# Altium schematic sheet 008_Fan_GPIO_LED.SchDoc: =title_line_1 + title_line_2
size 594 x 420 mm; SheetNumber: 8
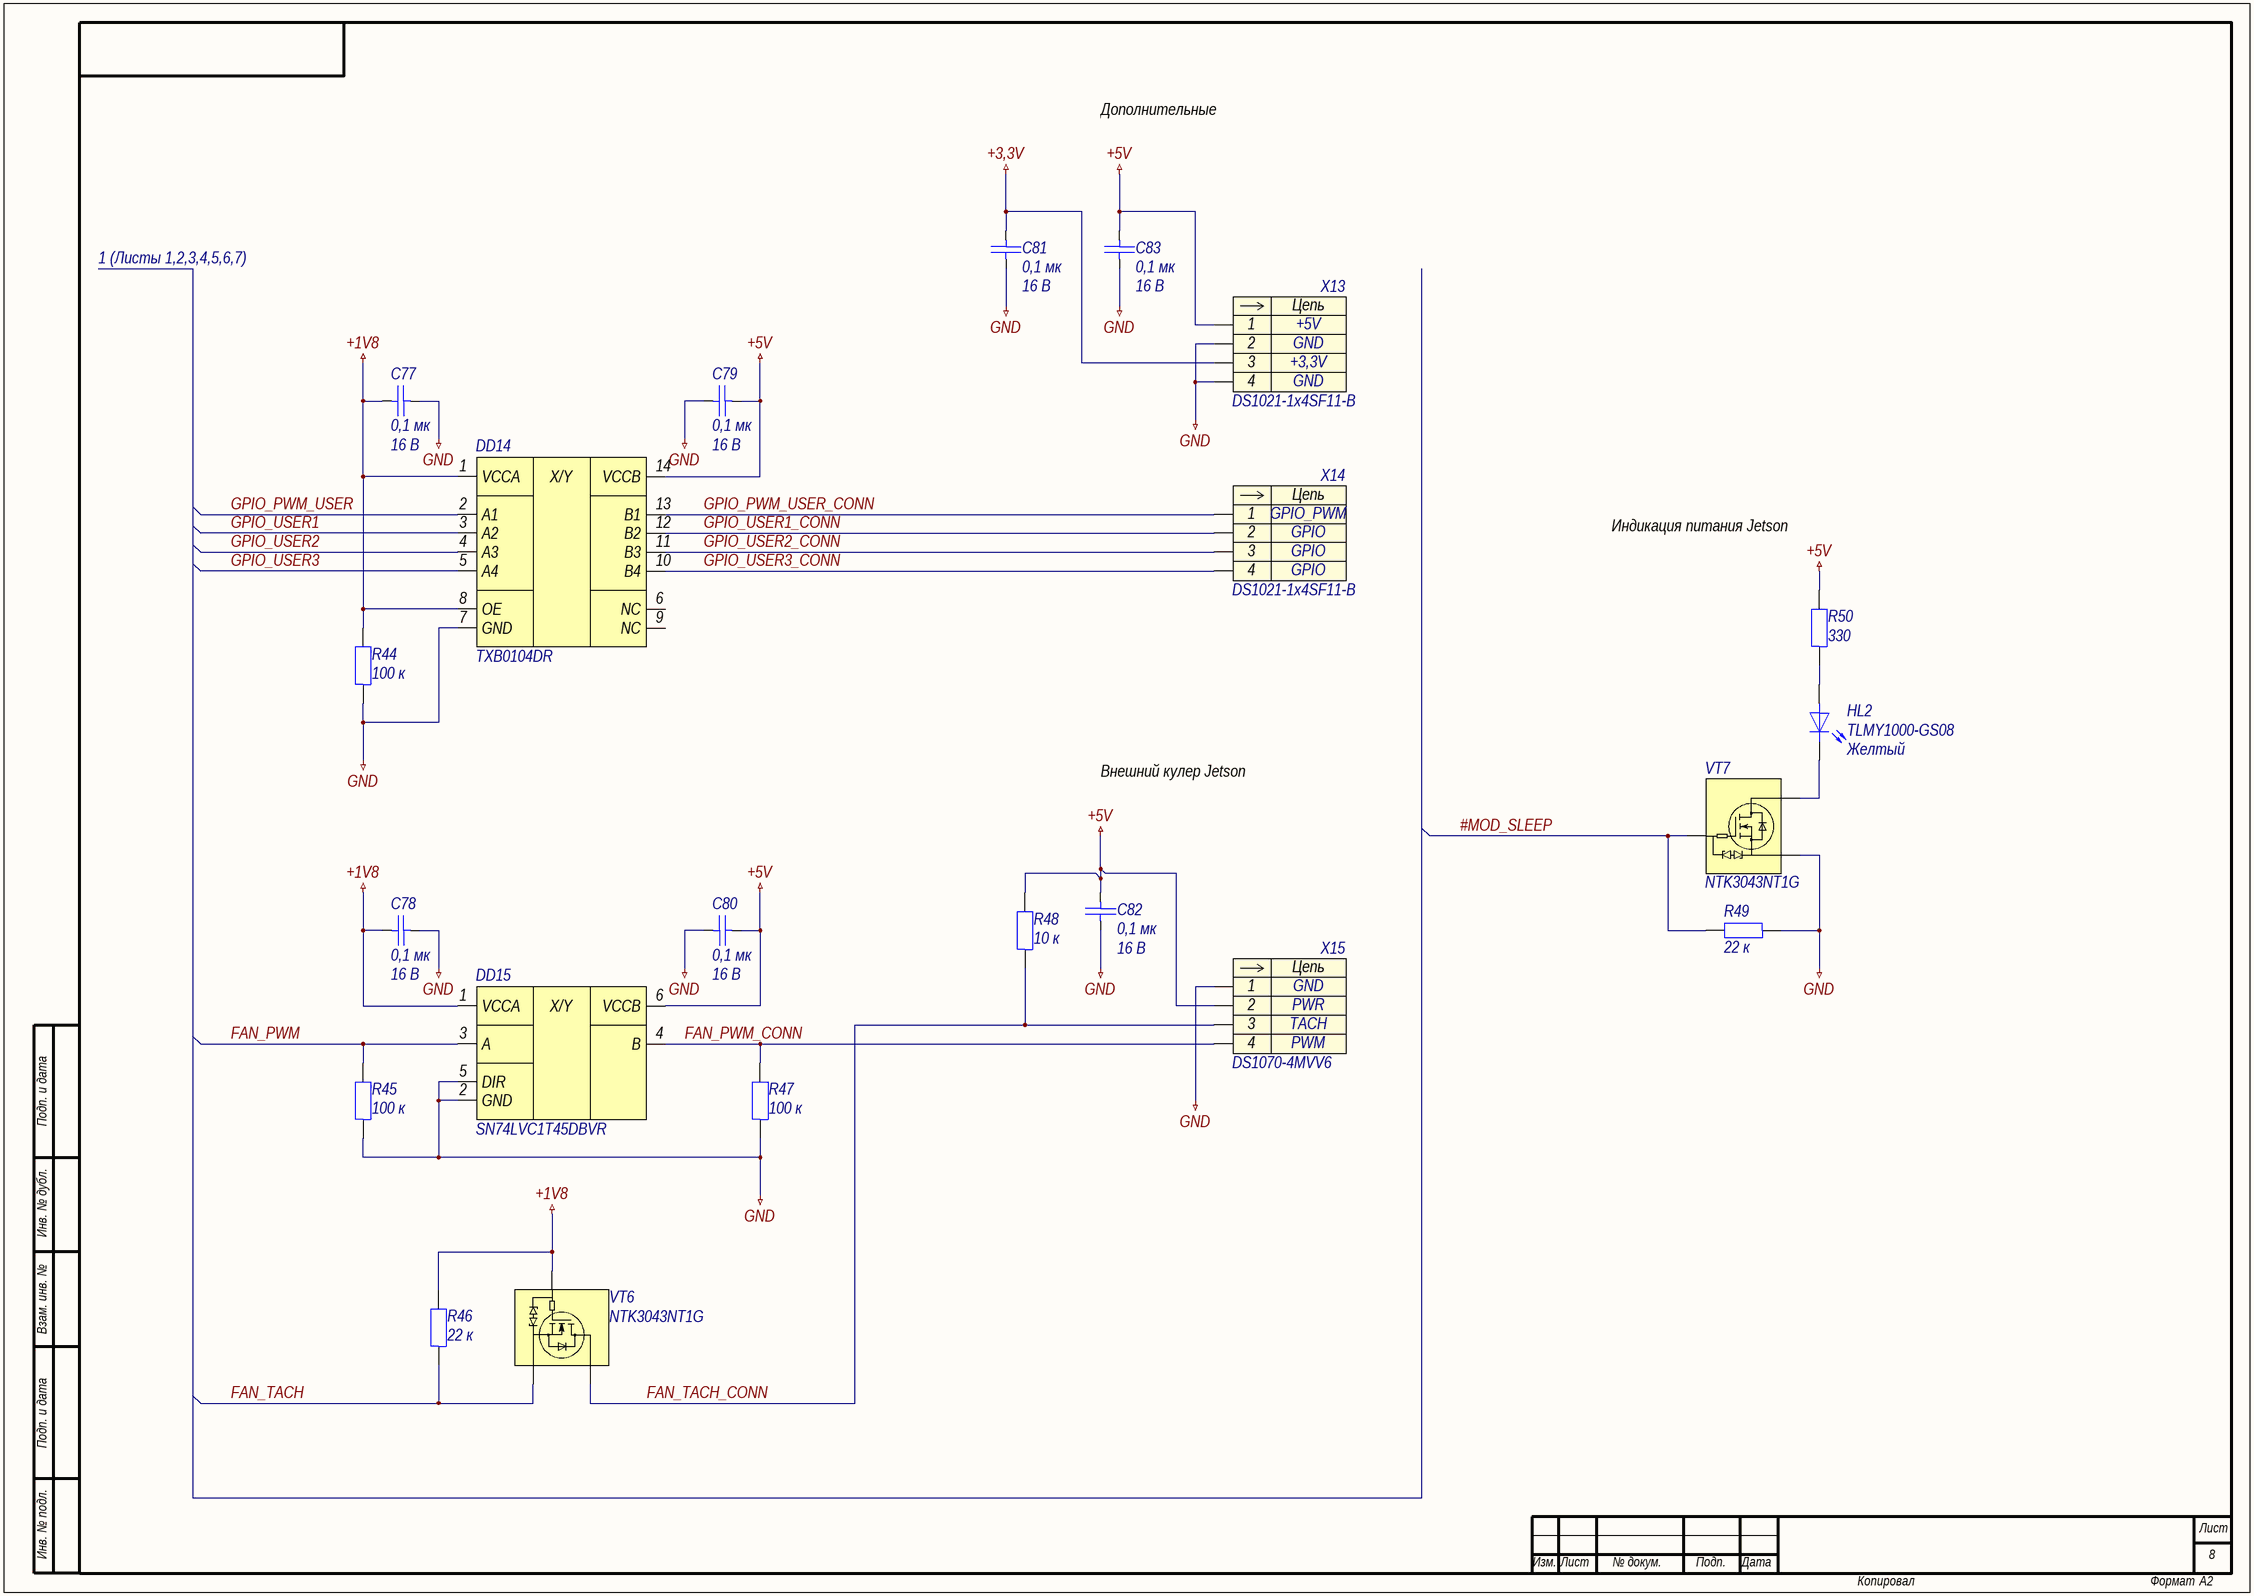
[diagram p0: 008_Fan_GPIO_LED.SchDoc]

## Parts
C77  0,1 мк  Напряжение: 16 В  [C0603]
C78  0,1 мк  Напряжение: 16 В  [C0603]
C79  0,1 мк  Напряжение: 16 В  [C0603]
C80  0,1 мк  Напряжение: 16 В  [C0603]
C81  0,1 мк  Напряжение: 16 В  [C0603]
C82  0,1 мк  Напряжение: 16 В  [C0603]
C83  0,1 мк  Напряжение: 16 В  [C0603]
DD14  TXB0104DR  [SOIC-14-P127-865X390X175-L84X41]
DD15  SN74LVC1T45DBVR  [SOT-23-6-P95-290X280X145]
HL2  TLMY1000-GS08  Цвет: Желтый  [HL0603]
R44  100 к  [R0603]
R45  100 к  [R0603]
R46  22 к  [R0603]
R47  100 к  [R0603]
R48  10 к  [R0603]
R49  22 к  [R0603]
R50  330  [R0603]
VT6  NTK3043NT1G  [SOT-723-3-P40-120X120X55]
VT7  NTK3043NT1G  [SOT-723-3-P40-120X120X55]
X13  DS1021-1x4SF11-B  [DS1021-1X4SF11-B]
X14  DS1021-1x4SF11-B  [DS1021-1X4SF11-B]
X15  DS1070-4MVV6  [DS1070-4MVV6]

## Nets
+1V8: C77.1 C78.1 DD14.1(VCCA) DD14.8(OE) DD15.1(VCCA) R44.2 R46.2 VT6.G
+3,3V: C81.2 X13.3
+5V: C79.2 C80.1 C82.2 C83.2 DD14.14(VCCB) DD15.6(VCCB) R48.2 R50.2 X13.1 X15.2
GND: C77.2 C78.2 C79.1 C80.2 C81.1 C82.1 C83.1 DD14.7(GND) DD15.2(GND) DD15.5(DIR) R44.1 R45.1 R47.1 R49.1 VT7.S X13.2 X13.4 X15.1
#MOD_SLEEP: R49.2 VT7.G
FAN_PWM: DD15.3(A) R45.2
FAN_PWM_CONN: DD15.4(B) R47.2 X15.4
FAN_TACH: R46.1 VT6.S
FAN_TACH_CONN: R48.1 VT6.D X15.3
GPIO_PWM_USER: DD14.2(A1)
GPIO_PWM_USER_CONN: DD14.13(B1) X14.1
GPIO_USER1: DD14.3(A2)
GPIO_USER1_CONN: DD14.12(B2) X14.2
GPIO_USER2: DD14.4(A3)
GPIO_USER2_CONN: DD14.11(B3) X14.3
GPIO_USER3: DD14.5(A4)
GPIO_USER3_CONN: DD14.10(B4) X14.4
NetHL2_1: HL2.1 VT7.D
NetHL2_2: HL2.2 R50.1

Not connected (* = marked no-connect by the designer): DD14 6(NC) 9(NC)

## Notes on the sheet
- Дополнительные функции
- 1 (Листы 1,2,3,4,5,6,7)
- Индикация питания Jetson Nano
- Внешний кулер Jetson Nano
- Подп. и дата
- Инв. № дубл.
- Взам. инв. №
- Инв. № подл.
- Лист
- Изм.
- № докум.
- Подп.
- Дата
- Копировал
- Формат
- А2
- (in symbol dd0001) X/Y
- (in symbol dd0002) X/Y
- (in symbol x0027) Цепь
- (in symbol x0048) Цепь

## Library data of the parts
C77-C83 = c0081: =Описание; ID: c0081; Фамилия: Паньков; Описание: Конденсатор керамический чип 0603 100 нФ 16 В ±10 %; Наименование: CC0603KRX7R7BB104; Производитель: YAGEO Corp.; Отклонение: ±10 %; Рабочие температуры: от –55 °С до +125 °С; Температурный коэффициент емкости: X7R; Корпус: 0603; Номинал: 0,1 мк; Номинальное напряжение: 16 В; HelpURL: https://www.yageo.com/upload/media/product/productsearch/datasheet/mlcc/UPY-GPHC_X7R_6.3V-to-50V_20.pdf
DD14 = dd0002: =Описание; ID: dd0002; Фамилия: Ларионов; Описание: Преобразователь логического уровня 3,6 В и 5,5 В 4 линии; Производитель: Texas Instruments Inc.; Входное напряжение: от 1,2 В до 3,6 В; Выходное напряжение: от 1,65 В до 5,5 В; Рабочие температуры: от –40 °С до +85 °С; Корпус: SOIC-14; Наименование: TXB0104DR; HelpURL: https://www.ti.com/product/TXB0104
DD15 = dd0001: =Описание; ID: dd0001; Фамилия: Ларионов; Описание: Преобразователь логического уровня 5,5 В и 5,5 В 1 линия; Производитель: Texas Instruments Inc.; Входное напряжение: от 1,08 В до 5,5 В; Выходное напряжение: от 1,65 В до 5,5 В; Рабочие температуры: от –40 °С до +85 °С; Корпус: SOT-23-6; Наименование: SN74LVC1T45DBVR; HelpURL: https://www.ti.com/product/SN74LVC1T45
HL2 = hl0003: =Описание; ID: hl0003; Фамилия: Ларионов; Описание: Светодиод чип 0603 желтый; Производитель: Vishay Intertechnology, Inc.; Номинальная сила света: 7,5 мкд; Номинальная длина волны: 588 нм; Номинальный прямой ток: 15 мА; Номинальное падение напряжения: 1,8 В; Рассеиваемая мощность: 40 мВт; Рабочие температуры: от –40 °С до +100 °С; Корпус: 0603; Наименование: TLMY1000-GS08; HelpURL: https://www.vishay.com/leds/list/product-83172/
R44 R45 R47 = r0141: =Описание; ID: r0141; Фамилия: Водорезов; Описание: Резистор чип 0603 100 кОм ±1 % 0,1 Вт; Наименование: RC0603FR-07100KL; Производитель: YAGEO Corp.; Отклонение: ±1 %; Номинальное напряжение: 75 В; Номинальный ток: 1 А; Рабочие температуры: от –55 °С до +155 °С; Корпус: 0603; Примечание: Ряд E24; Номинал: 100 к; HelpURL: https://www.yageo.com/upload/media/product/productsearch/datasheet/rchip/PYu-RC_Group_51_RoHS_L_11.pdf
R46 R49 = r0117: =Описание; ID: r0117; Фамилия: Паньков; Описание: Резистор чип 0603 22 кОм ±1 % 0,1 Вт; Наименование: RC0603FR-0722KL; Производитель: YAGEO Corp.; Отклонение: ±1 %; Номинальное напряжение: 75 В; Номинальный ток: 1 А; Рабочие температуры: от –55 °С до +155 °С; Корпус: 0603; Примечание: Ряд E24; Номинал: 22 к; HelpURL: https://www.yageo.com/upload/media/product/productsearch/datasheet/rchip/PYu-RC_Group_51_RoHS_L_11.pdf
R48 = r0105: =Описание; ID: r0105; Фамилия: Самарин; Описание: Резистор чип 0603 10 кОм ±1 % 0,1 Вт; Наименование: RC0603FR-0710KL; Производитель: YAGEO Corp.; Отклонение: ±1 %; Номинальное напряжение: 75 В; Номинальный ток: 1 А; Рабочие температуры: от –55 °С до +155 °С; Корпус: 0603; Примечание: Ряд E24; Номинал: 10 к; HelpURL: https://www.yageo.com/upload/media/product/productsearch/datasheet/rchip/PYu-RC_Group_51_RoHS_L_11.pdf
R50 = r0064: =Описание; ID: r0064; Фамилия: Ларионов; Описание: Резистор чип 0603 330 Ом ±1 % 0,1 Вт; Наименование: RC0603FR-07330RL; Производитель: YAGEO Corp.; Отклонение: ±1 %; Номинальное напряжение: 75 В; Номинальный ток: 1 А; Рабочие температуры: от –55 °С до +155 °С; Корпус: 0603; Примечание: Ряд E24; Номинал: 330; HelpURL: https://www.yageo.com/upload/media/product/productsearch/datasheet/rchip/PYu-RC_Group_51_RoHS_L_11.pdf
VT6 VT7 = vt0001: =Описание; ID: vt0001; Фамилия: Ларионов; Описание: Полевой N-канальный МДП-транзистор 20 В 0,255 А; Производитель: ON Semiconductor; Напряжение затвор — исток: ±10 В; Напряжение сток — исток: 20 В; Ток стока: 0,255 А; Сопротивление сток — исток: 15 Ом; Рабочие температуры: от –55 °С до +150 °С; Корпус: SOT-723; Наименование: NTK3043NT1G; HelpURL: https://www.onsemi.com/products/discretes-drivers/mosfets/ntk3043n
X13 = x0027: =Описание; Contact_1: +5V; Contact_2: GND; Contact_3: +3,3V; ID: x0027; Фамилия: Паньков; Описание: PLS 4 pin 2,54 мм вилка прямой; Производитель: Connfly Electronic Co., Ltd.; Contact_4: GND; Наименование: DS1021-1x4SF11-B; HelpURL: http://en.connfly.group/product/xVkr=EusQssAN0gN=Aos=mU+UrVkR9kqEAN0gN9g+WqANB+A
X14 = x0027: =Описание; Contact_1: GPIO_PWM; Contact_2: GPIO; ID: x0027; Фамилия: Паньков; Описание: PLS 4 pin 2,54 мм вилка прямой; Производитель: Connfly Electronic Co., Ltd.; Contact_3: GPIO; Contact_4: GPIO; Наименование: DS1021-1x4SF11-B; HelpURL: http://en.connfly.group/product/xVkr=EusQssAN0gN=Aos=mU+UrVkR9kqEAN0gN9g+WqANB+A
X15 = x0048: =Описание; Contact_1: GND; Contact_2: PWR; Contact_3: TACH; Contact_4: PWM; ID: x0048; Фамилия: Ларионов; Описание: Power Connector 4 pin 2,54 мм вилка прямой; Производитель: Connfly Electronic Co., Ltd.; Наименование: DS1070-4MVV6; HelpURL: http://en.connfly.group/product/xVkr=EusQssAN0gN=Aos=mU+UrVkR9kqEAN0gN0MUqANB+A